# Altium schematic sheet DSP_connectors.SchDoc
size A; SheetNumber: 2; SheetTotal: 6
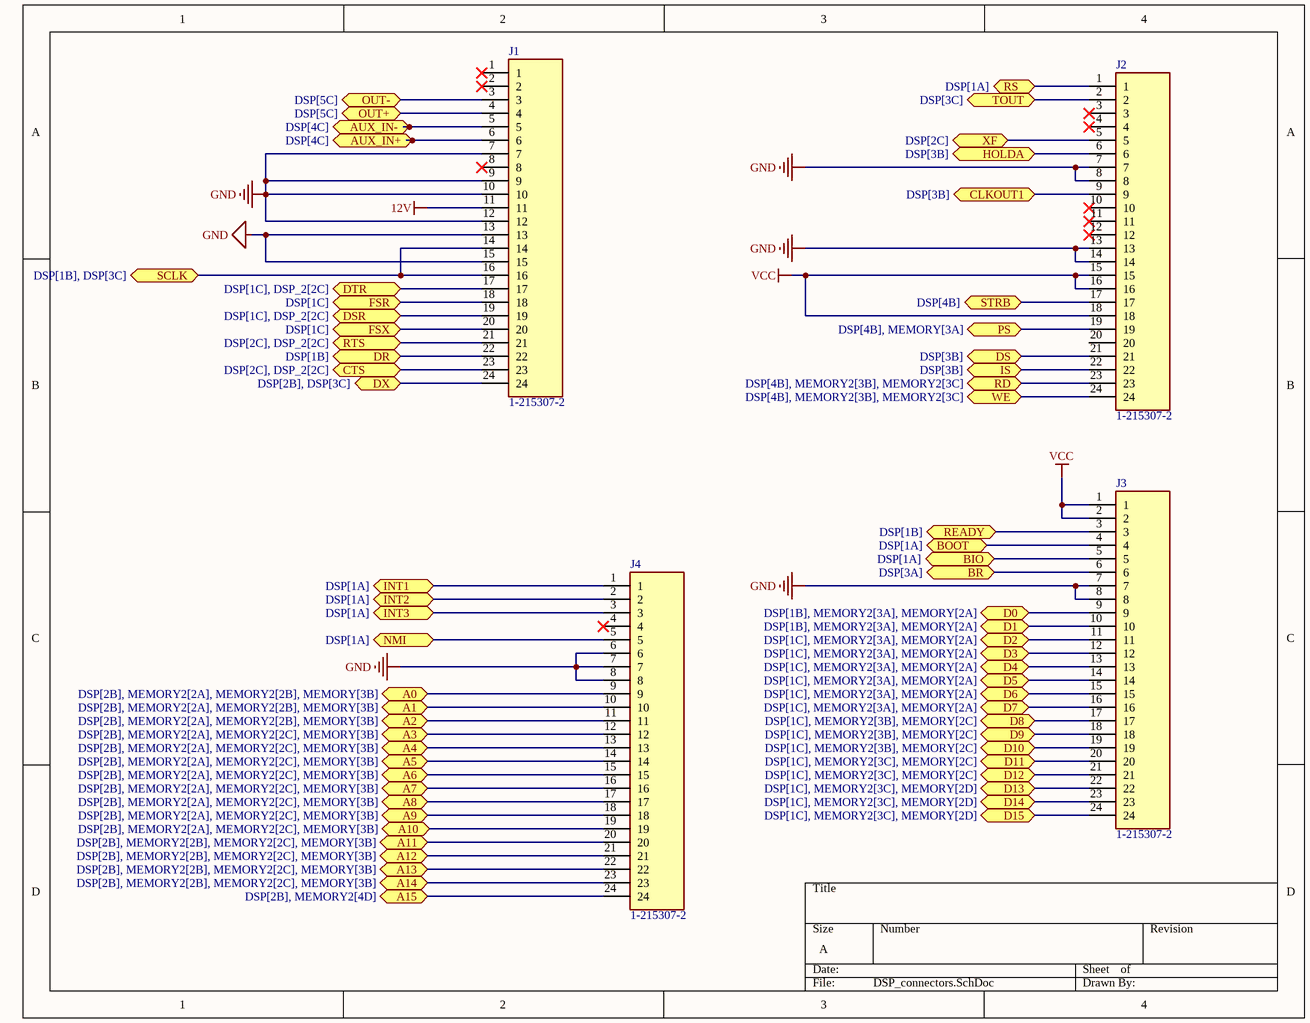
[diagram p0: DSP_connectors.SchDoc]

## Parts
J1  1-215307-2  [TE_1-215307-2]
J2  1-215307-2  [TE_1-215307-2]
J3  1-215307-2  [TE_1-215307-2]
J4  1-215307-2  [TE_1-215307-2]

## Ports
A0 (bidir, see DSP[2B], MEMORY2[2A], MEMORY2[2B], MEMORY[3B]), A1 (bidir, see DSP[2B], MEMORY2[2A], MEMORY2[2B], MEMORY[3B]), A2 (bidir, see DSP[2B], MEMORY2[2A], MEMORY2[2B], MEMORY[3B]), A3 (bidir, see DSP[2B], MEMORY2[2A], MEMORY2[2C], MEMORY[3B]), A4 (bidir, see DSP[2B], MEMORY2[2A], MEMORY2[2C], MEMORY[3B]), A5 (bidir, see DSP[2B], MEMORY2[2A], MEMORY2[2C], MEMORY[3B]), A6 (bidir, see DSP[2B], MEMORY2[2A], MEMORY2[2C], MEMORY[3B]), A7 (bidir, see DSP[2B], MEMORY2[2A], MEMORY2[2C], MEMORY[3B]), A8 (bidir, see DSP[2B], MEMORY2[2A], MEMORY2[2C], MEMORY[3B]), A9 (bidir, see DSP[2B], MEMORY2[2A], MEMORY2[2C], MEMORY[3B]), A10 (bidir, see DSP[2B], MEMORY2[2A], MEMORY2[2C], MEMORY[3B]), A11 (bidir, see DSP[2B], MEMORY2[2B], MEMORY2[2C], MEMORY[3B]), A12 (bidir, see DSP[2B], MEMORY2[2B], MEMORY2[2C], MEMORY[3B]), A13 (bidir, see DSP[2B], MEMORY2[2B], MEMORY2[2C], MEMORY[3B]), A14 (bidir, see DSP[2B], MEMORY2[2B], MEMORY2[2C], MEMORY[3B]), A15 (bidir, see DSP[2B], MEMORY2[4D]), AUX_IN+ (bidir, see DSP[4C]), AUX_IN- (bidir, see DSP[4C]), BIO (bidir, see DSP[1A]), BOOT (bidir, see DSP[1A]), BR (bidir, see DSP[3A]), CLKOUT1 (bidir, see DSP[3B]), CTS (bidir, see DSP[2C], DSP_2[2C]), D0 (bidir, see DSP[1B], MEMORY2[3A], MEMORY[2A]), D1 (bidir, see DSP[1B], MEMORY2[3A], MEMORY[2A]), D2 (bidir, see DSP[1C], MEMORY2[3A], MEMORY[2A]), D3 (bidir, see DSP[1C], MEMORY2[3A], MEMORY[2A]), D4 (bidir, see DSP[1C], MEMORY2[3A], MEMORY[2A]), D5 (bidir, see DSP[1C], MEMORY2[3A], MEMORY[2A]), D6 (bidir, see DSP[1C], MEMORY2[3A], MEMORY[2A]), D7 (bidir, see DSP[1C], MEMORY2[3A], MEMORY[2A]), D8 (bidir, see DSP[1C], MEMORY2[3B], MEMORY[2C]), D9 (bidir, see DSP[1C], MEMORY2[3B], MEMORY[2C]), D10 (bidir, see DSP[1C], MEMORY2[3B], MEMORY[2C]), D11 (bidir, see DSP[1C], MEMORY2[3C], MEMORY[2C]), D12 (bidir, see DSP[1C], MEMORY2[3C], MEMORY[2C]), D13 (bidir, see DSP[1C], MEMORY2[3C], MEMORY[2D]), D14 (bidir, see DSP[1C], MEMORY2[3C], MEMORY[2D]), D15 (bidir, see DSP[1C], MEMORY2[3C], MEMORY[2D]), DR (bidir, see DSP[1B]), DS (bidir, see DSP[3B]), DSR (bidir, see DSP[1C], DSP_2[2C]), DTR (bidir, see DSP[1C], DSP_2[2C]), DX (bidir, see DSP[2B], DSP[3C]), FSR (bidir, see DSP[1C]), FSX (bidir, see DSP[1C]), HOLDA (bidir, see DSP[3B]), INT1 (bidir, see DSP[1A]), INT2 (bidir, see DSP[1A]), INT3 (bidir, see DSP[1A]), IS (bidir, see DSP[3B]), NMI (bidir, see DSP[1A]), OUT+ (bidir, see DSP[5C]), OUT- (bidir, see DSP[5C]), PS (bidir, see DSP[4B], MEMORY[3A]), RD (bidir, see DSP[4B], MEMORY2[3B], MEMORY2[3C]), READY (bidir, see DSP[1B]), RS (bidir, see DSP[1A]), RTS (bidir, see DSP[2C], DSP_2[2C]), SCLK (bidir, see DSP[1B], DSP[3C]), STRB (bidir, see DSP[4B]), TOUT (bidir, see DSP[3C]), WE (bidir, see DSP[4B], MEMORY2[3B], MEMORY2[3C]), XF (bidir, see DSP[2C])

## Nets
12V: J1.11
GND: J1.7 J1.9 J1.10 J1.12 J1.13 J1.15 J2.7 J2.8 J2.13 J2.14 J3.7 J3.8 J4.6 J4.7 J4.8
VCC: J2.15 J2.16 J2.18 J3.1 J3.2
A0: J4.9 ; port A0
A1: J4.10 ; port A1
A2: J4.11 ; port A2
A3: J4.12 ; port A3
A4: J4.13 ; port A4
A5: J4.14 ; port A5
A6: J4.15 ; port A6
A7: J4.16 ; port A7
A8: J4.17 ; port A8
A9: J4.18 ; port A9
A10: J4.19 ; port A10
A11: J4.20 ; port A11
A12: J4.21 ; port A12
A13: J4.22 ; port A13
A14: J4.23 ; port A14
A15: J4.24 ; port A15
AUX_IN+: J1.6 ; port AUX_IN+
AUX_IN-: J1.5 ; port AUX_IN-
BIO: J3.5 ; port BIO
BOOT: J3.4 ; port BOOT
BR: J3.6 ; port BR
CLKOUT1: J2.9 ; port CLKOUT1
CTS: J1.23 ; port CTS
D0: J3.9 ; port D0
D1: J3.10 ; port D1
D2: J3.11 ; port D2
D3: J3.12 ; port D3
D4: J3.13 ; port D4
D5: J3.14 ; port D5
D6: J3.15 ; port D6
D7: J3.16 ; port D7
D8: J3.17 ; port D8
D9: J3.18 ; port D9
D10: J3.19 ; port D10
D11: J3.20 ; port D11
D12: J3.21 ; port D12
D13: J3.22 ; port D13
D14: J3.23 ; port D14
D15: J3.24 ; port D15
DR: J1.22 ; port DR
DS: J2.21 ; port DS
DSR: J1.19 ; port DSR
DTR: J1.17 ; port DTR
DX: J1.24 ; port DX
FSR: J1.18 ; port FSR
FSX: J1.20 ; port FSX
HOLDA: J2.6 ; port HOLDA
INT1: J4.1 ; port INT1
INT2: J4.2 ; port INT2
INT3: J4.3 ; port INT3
IS: J2.22 ; port IS
NMI: J4.5 ; port NMI
OUT+: J1.4 ; port OUT+
OUT-: J1.3 ; port OUT-
PS: J2.19 ; port PS
RD: J2.23 ; port RD
READY: J3.3 ; port READY
RS: J2.1 ; port RS
RTS: J1.21 ; port RTS
SCLK: J1.14 J1.16 ; port SCLK
STRB: J2.17 ; port STRB
TOUT: J2.2 ; port TOUT
WE: J2.24 ; port WE
XF: J2.5 ; port XF

Not connected (* = marked no-connect by the designer): J1 1* 2* 8*; J2 3* 4* 10* 11* 12* 20; J4 4*

## Library data of the parts
J1-J4 = 1-215307-2: Package: None; Price: None; Value: *; MP: 1-215307-2; Availability: Unavailable